# EAGLE design v0.4.5 (EAGLE 7.1.0)
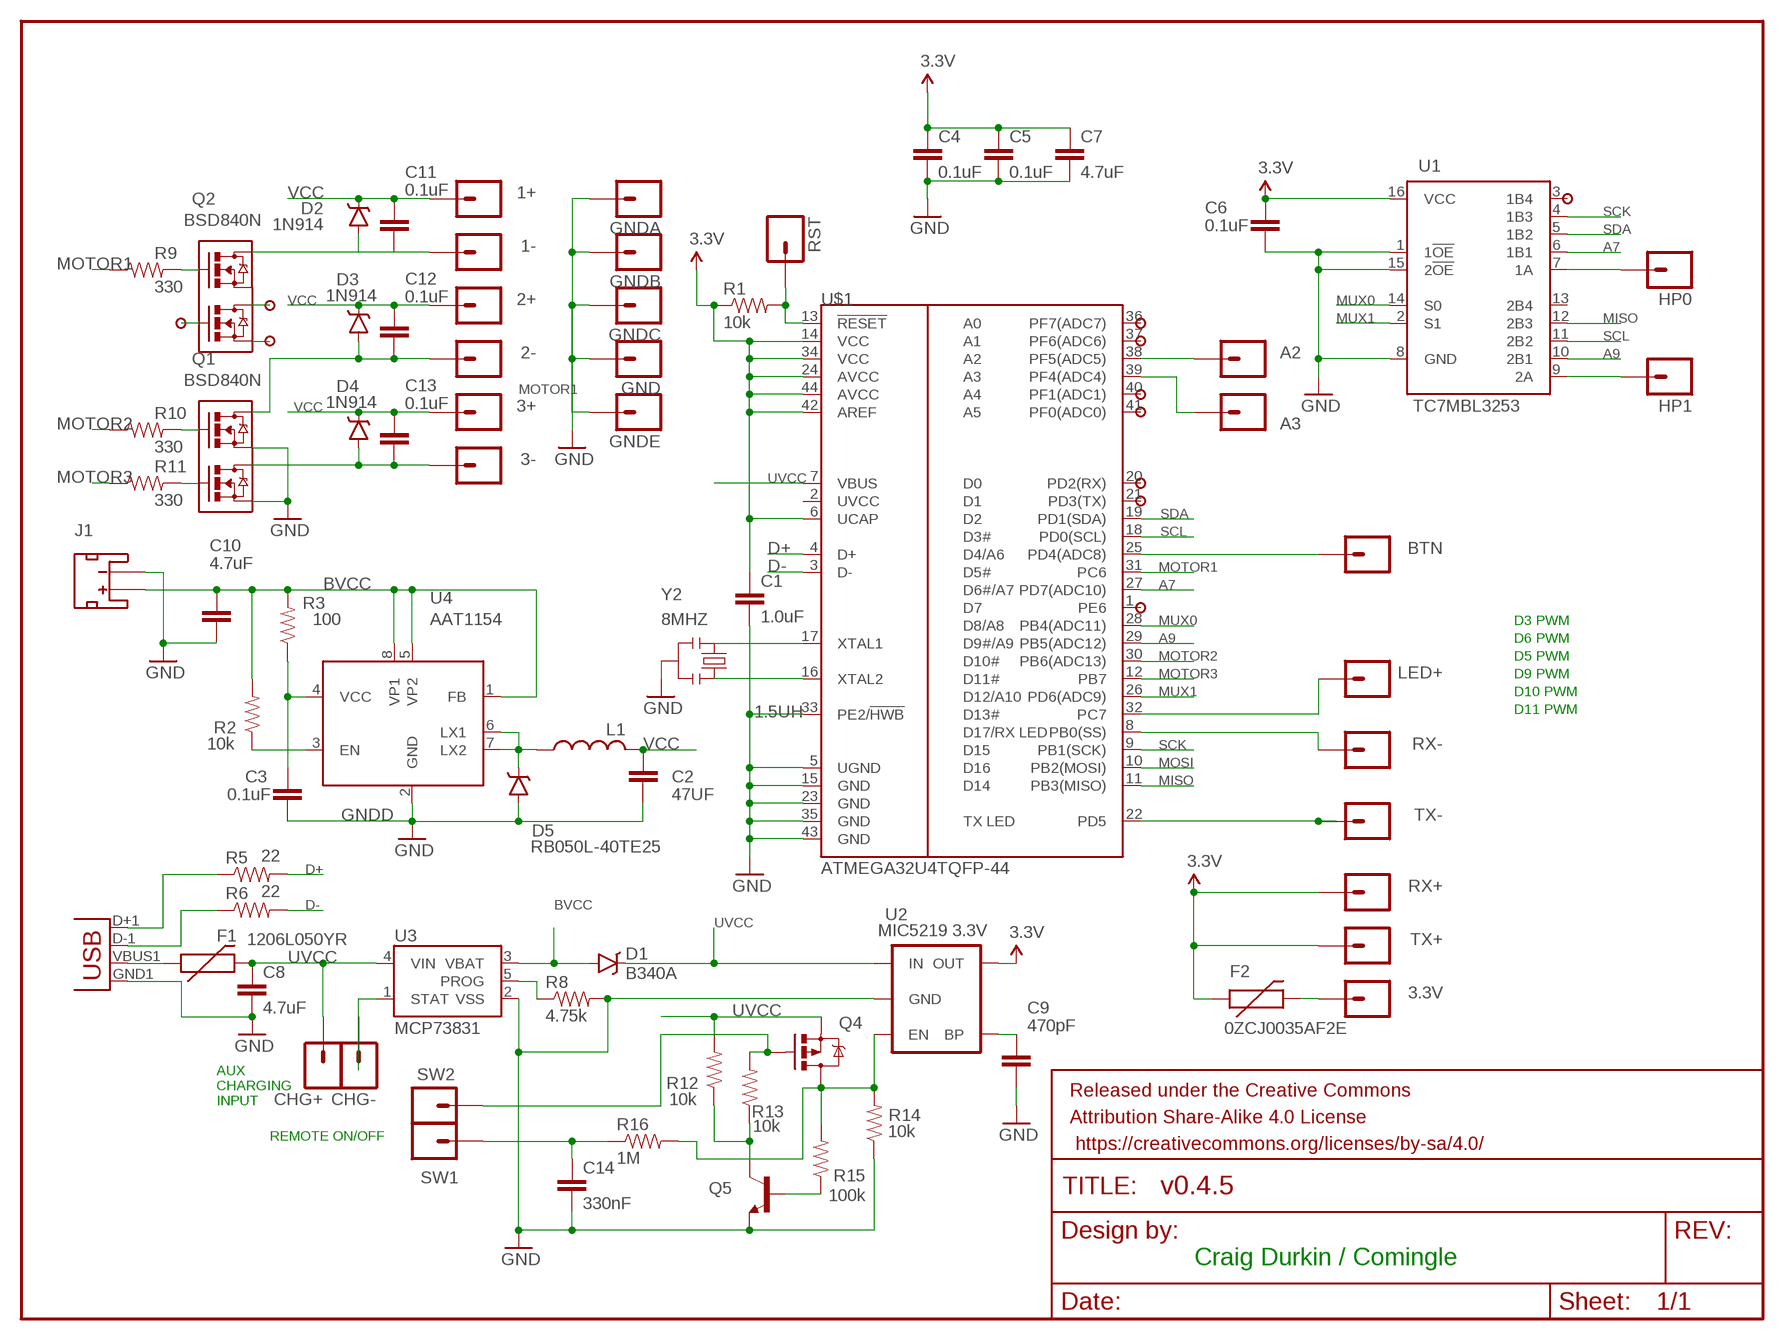
[diagram p0: schematic, sheet 1]

## Parts
1+  M01PTH  [1X01]
1-  M01PTH  [1X01]
2+  M01PTH  [1X01]
2-  M01PTH  [1X01]
3+  M01PTH  [1X01]
3-  M01PTH  [1X01]
3.3V  M01PTH  [1X01]
A2  M01PTH  [1X01]
A3  M01PTH  [1X01]
BTN  M01PTH  [1X01]
C1  1.0uF  CAP0603-CAP  [0603-CAP]
C2  47UF  CAP0805  [0805]
C3  0.1uF  CAP0603-CAP  [0603-CAP]
C4  0.1uF  CAP0603-CAP  [0603-CAP]
C5  0.1uF  CAP0603-CAP  [0603-CAP]
C6  0.1uF  CAP0603-CAP  [0603-CAP]
C7  4.7uF  CAP0603-CAP  [0603-CAP]
C8  4.7uF  CAP1206  [1206]
C9  470pF  CAP0603-CAP  [0603-CAP]
C10  4.7uF  CAP1206  [1206]
C11  0.1uF  CAP0603-CAP  [0603-CAP]
C12  0.1uF  CAP0603-CAP  [0603-CAP]
C13  0.1uF  CAP0603-CAP  [0603-CAP]
C14  330nF  CAP0603-CAP  [0603-CAP]
CHG+  M01PTH  [1X01]
CHG-  M01PTH  [1X01]
D1  B340A  DIODE-SCHOTTKY-B340A  [SMA-DIODE]
D2  1N914  BAT20JFILM  [SOD-323]
D3  1N914  BAT20JFILM  [SOD-323]
D4  1N914  BAT20JFILM  [SOD-323]
D5  RB050L-40TE25  DIODE-SCHOTTKY-B340A  [SMA-DIODE]
F1  1206L050YR  PTCSMD  [PTC-1206]
F2  0ZCJ0035AF2E  PTCSMD  [PTC-1206]
FRAME1  FRAME-LETTER  [CREATIVE_COMMONS]
GND  M01PTH  [1X01]
GNDA  M01PTH  [1X01]
GNDB  M01PTH  [1X01]
GNDC  M01PTH  [1X01]
GNDE  M01PTH  [1X01]
HP0  M01PTH  [1X01]
HP1  M01PTH  [1X01]
J1  JST_2MM_MALE  [JST-2-SMD]
JP4  USB  [USB-B-MICRO-SMD_V03]
L1  1.5UH  LQH5BPN1R5NT0L_INDUCTOR  [CHOKE_5MM]
LED+  M01PTH  [1X01]
PD2  040_PAD_030_HOLE  [040_PAD_O30_HOLE]
PD3  040_PAD_030_HOLE  [040_PAD_O30_HOLE]
PD4  040_PAD_030_HOLE  [040_PAD_O30_HOLE]
PD5  040_PAD_030_HOLE  [040_PAD_O30_HOLE]
PD6  040_PAD_030_HOLE  [040_PAD_O30_HOLE]
PD7  040_PAD_030_HOLE  [040_PAD_O30_HOLE]
PD8  040_PAD_030_HOLE  [040_PAD_O30_HOLE]
PD9  040_PAD_030_HOLE  [040_PAD_O30_HOLE]
PD10  040_PAD_030_HOLE  [040_PAD_O30_HOLE]
PD11  040_PAD_030_HOLE  [040_PAD_O30_HOLE]
PD12  040_PAD_030_HOLE  [040_PAD_O30_HOLE]
Q1  BSD840N  [PG-SOT-363]
Q2  BSD840N  [PG-SOT-363]
Q4  NTS2101PT1G  MOSFET-PCHANNEL  [SOT23-3]
Q5  MMBT2222A  TRANSISTOR_NPNMMBT2222A  [SOT23-3]
R1  10k  RESISTOR0603-RES  [0603-RES]
R2  10k  RESISTOR0603-RES  [0603-RES]
R3  100  RESISTOR0603-RES  [0603-RES]
R5  22  RESISTOR0603-RES  [0603-RES]
R6  22  RESISTOR0603-RES  [0603-RES]
R8  4.75k  RESISTOR0603-RES  [0603-RES]
R9  330  RESISTOR0603-RES  [0603-RES]
R10  330  RESISTOR0603-RES  [0603-RES]
R11  330  RESISTOR0603-RES  [0603-RES]
R12  10k  RESISTOR0603-RES  [0603-RES]
R13  10k  RESISTOR0603-RES  [0603-RES]
R14  10k  RESISTOR0603-RES  [0603-RES]
R15  100k  RESISTOR0603-RES  [0603-RES]
R16  1M  RESISTOR0603-RES  [0603-RES]
RST  M01PTH  [1X01]
RX+  M01PTH  [1X01]
RX-  M01PTH  [1X01]
SW1  M01PTH  [1X01]
SW2  M01PTH  [1X01]
TX+  M01PTH  [1X01]
TX-  M01PTH  [1X01]
U1  TC7MBL3253  [SSOP16-PRACTICE]
U2  MIC5219 3.3V  V_REG_MIC52193.3V  [SOT23-5]
U3  MCP73831  [SOT23-5]
U4  AAT1154  [SOP-8]
U$1  ATMEGA32U4TQFP-44  [TQFP44]
Y2  8MHZ  RESONATOR8MHZ  [RESONATOR-SMD]

## Nets
A7: U1.6(1B1) U$1.27(PD7(ADC10))
A9: U1.10(2B1) U$1.29(PB5(ADC12))
BVCC: C10.1 D1.A J1.2(+) R2.2 R3.2 U3.3(VBAT) U4.1(FB) U4.5(VP2) U4.8(VP1)
D+: R5.2 U$1.4(D+)
D-: R6.2 U$1.3(D-)
GNDD: C1.2 C2.2 C3.2 C4.2 C5.2 C6.2 C7.2 C8.2 C9.2 C10.2 C14.2 D5.A GND.1 GNDA.1 GNDB.1 GNDC.1 GNDE.1 J1.1(-) JP4.GND1(GND) Q1.1(S) Q1.4(S1) Q5.2(E) R8.2 R14.1 U1.1(1!OE) U1.8(GND) U1.15(2!OE) U2.2(GND) U3.2(VSS) U4.2(GND) U$1.5(UGND) U$1.15(GND) U$1.23(GND) U$1.33(PE2/!HWB) U$1.35(GND) U$1.43(GND) Y2.2 ; supply symbol labelled GND
MISO: U1.12(2B3) U$1.11(PB3(MISO))
MOSI: U$1.10(PB2(MOSI))
MOTOR1: R9.1 U$1.31(PC6)
MOTOR2: R10.1 U$1.30(PB6(ADC13))
MOTOR3: R11.1 U$1.12(PB7)
MUX0: U1.14(S0) U$1.28(PB4(ADC11))
MUX1: U1.2(S1) U$1.26(PD6(ADC9))
N$1: U$1.17(XTAL1) Y2.1
N$2: R8.1 U3.5(PROG)
N$3: D5.C L1.1 U4.6(LX1) U4.7(LX2)
N$4: F1.1 JP4.VBUS1(VBUS)
N$5: 3.3V.1 F2.2
N$6: U$1.16(XTAL2) Y2.3
N$7: LED+.1 U$1.32(PC7)
N$8: RX-.1 U$1.8(PB0(SS))
N$9: TX-.1 U$1.22(PD5)
N$10: JP4.D+1(D+) R5.1
N$11: JP4.D-1(D-) R6.1
N$12: Q4.3(D) R14.2 R15.2 R16.2 U2.3(EN)
N$13: HP1.1 U1.9(2A)
N$14: HP0.1 U1.7(1A)
N$15: A2.1 U$1.38(PF5(ADC5))
N$16: A3.1 U$1.39(PF4(ADC4))
N$17: BTN.1 U$1.25(PD4(ADC8))
N$18: Q2.2(G) R9.2
N$19: CHG-.1 U3.1(STAT)
N$20: Q5.3(C) R12.1 R13.1
N$21: C14.1 R16.1 SW1.1
N$22: C9.1 U2.4(BP)
N$23: Q4.1(G) R13.2 SW2.1
N$24: 1-.1 C11.2 D2.A Q2.6(D)
N$25: 2-.1 C12.2 D3.A Q1.6(D)
N$26: 3-.1 C13.2 D4.A Q1.3(D1)
N$27: PD3.1 U$1.21(PD3(TX))
N$28: PD4.1 U$1.20(PD2(RX))
N$29: PD5.1 U$1.41(PF0(ADC0))
N$30: Q5.1(B) R15.1
N$31: R2.1 U4.3(EN)
N$32: C3.1 R3.1 U4.4(VCC)
N$33: PD6.1 U$1.40(PF1(ADC1))
N$34: PD7.1 U$1.37(PF6(ADC6))
N$35: PD8.1 U$1.36(PF7(ADC7))
N$36: PD9.1 U$1.1(PE6)
N$38: PD2.1 U1.3(1B4)
N$40: PD10.1 Q2.5(G1)
N$41: PD11.1 Q2.4(S1)
N$42: PD12.1 Q2.3(D1)
N$43: Q1.2(G) R10.2
N$44: Q1.5(G1) R11.2
RST: R1.2 RST.1 U$1.13(!RESET)
SCK: U1.4(1B3) U$1.9(PB1(SCK))
SCL: U1.11(2B2) U$1.18(PD0(SCL))
SDA: U1.5(1B2) U$1.19(PD1(SDA))
UVCC: C8.1 CHG+.1 D1.C F1.2 Q4.2(S) R12.2 U2.1(IN) U3.4(VIN) U$1.7(VBUS)
VCC: 1+.1 2+.1 3+.1 C1.1 C2.1 C4.1 C5.1 C6.1 C7.1 C11.1 C12.1 C13.1 D2.C D3.C D4.C F2.1 L1.2 R1.1 RX+.1 TX+.1 U1.16(VCC) U2.5(OUT) U$1.6(UCAP) U$1.14(VCC) U$1.24(AVCC) U$1.34(VCC) U$1.42(AREF) U$1.44(AVCC) ; supply symbol labelled 3.3V
Unconnected: J1.NC1(PAD1) J1.NC2(PAD2) Q2.1(S) U1.13(2B4) U$1.2(UVCC)

## Notes on the sheet
- D3 PWM
- D6 PWM
- D5 PWM
- D9 PWM
- D10 PWM
- D11 PWM
- AUX
  CHARGING
  INPUT
- REMOTE ON/OFF
- Craig Durkin / Comingle

## Library data of the parts
1+ 1- 2+ 2- 3+ 3- 3.3V A2 A3 BTN CHG+ CHG- GND GNDA GNDB GNDC GNDE HP0 HP1 LED+ RST RX+ RX- SW1 SW2 TX+ TX- = SparkFun-Connectors:M01: Header 1 Standard 1-pin 0.1" header. Use with straight break away headers (SKU : PRT-00116), right angle break away headers (PRT-00553), swiss pins (PRT-00743), machine pins (PRT-00117), and female headers (PRT-00115).
C1 C9 C11-C14 = SparkFun-Capacitors:CAP: Capacitor Standard 0603 ceramic capacitor, and 0.1" leaded capacitor.
C2 = v0.4.5:CAP: Capacitor Standard 0603 ceramic capacitor, and 0.1" leaded capacitor.
C3-C8 C10 = SparkFun-Passives:CAP: Capacitor Standard 0603 ceramic capacitor, and 0.1" leaded capacitor.
D1 = SparkFun-DiscreteSemi:DIODE-SCHOTTKY: Schottky diodes in SFE's production catalog BAT20J 1A 23V 0.62Vf RB751 120mA 40V 0.37Vf PMEG4005EJ 0.5A 40V 0.42Vf MBRA140 1A 40V 0.5Vf B340A 3A 40V SMA; PROD_ID: DIO-09886
D2-D4 = SparkFun-DiscreteSemi:BAT20JFILM: 23V, 1A Schottky diode, SOD-323 package; PROD_ID: DIO-11623; VALUE: BAT20JFILM
D5 = v0.4.5:DIODE-SCHOTTKY: Schottky diodes in SFE's production catalog BAT20J 1A 23V 0.62Vf RB751 120mA 40V 0.37Vf PMEG4005EJ 0.5A 40V 0.42Vf MBRA140 1A 40V 0.5Vf B340A 3A 40V SMA; PROD_ID: DIO-09886; VALUE: B340A
F1 F2 = SparkFun-PowerIC:PTC: Resettable Fuse PTC Resettable Fuse. Spark Fun Electronics SKU : COM-08357; PROD_ID: RES-11150
FRAME1 = SparkFun-Aesthetics:FRAME-LETTER: Schematic Frame Standard 8.5x11 US Letter frame
J1 = SparkFun-Connectors:JST_2MM_MALE: Mates to single-cell LiPo batteries. CONN-08352; PROD_ID: CONN-08352
JP4 = SparkFun-Connectors:USB: USB Connectors USB-B-PTH is fully proven SKU : PRT-00139/CONN-08278 USB-miniB is fully proven SKU : PRT-00587 USB-A-PCB is untested. USB-A-H is throughly reviewed, but untested. Spark Fun Electronics SKU : PRT-00437 USB-B-SMT is throughly reviewed, but untested. Needs silkscreen touching up. USB-A-S has not been used/tested USB-MB-H has not been used/tested USB-MICROB has been used. CONN-09505
L1 = v0.4.5:LQH5BPN1R5NT0L_INDUCTOR
PD2-PD12 = CLAVE:040_PAD_030_HOLE
Q1 Q2 = v0.4.5:BSD840N
Q4 = SparkFun-DiscreteSemi:MOSFET-PCHANNEL: Generic PMOSFET IRLML2244 - TRANS-11153 (SOT-23 -20V -4.3A) (1.Gate 2.Source 3.Drain) FQP27P06 - COM-10349 <http://www.sparkfun.com/products/10349> (TO-220 -60V -27A) (1.Gate 2.Source 3.Drain); PROD_ID: TRANS-08285
Q5 = SparkFun-DiscreteSemi:TRANSISTOR_NPN: Generic NPN BJT MMBT2222A - TRANS-08049 (SOT-23, 1A 40V) MPSA42 - TRANS-09116 (SOT-23, 500mA 300V) MMBT5088LT1G - TRANS-11160 (SOT-23, 50 mA 30V) BC547 - COM-08928 <http://www.sparkfun.com/products/8928> (TO-92 45V 100mA) (1.Collector 2.Base 3.Emitter) 2N3904 - COM-00521 <http://www.sparkfun.com/products/521> (TO-92 40V 200mA) (1.Emitter 2.Base 3.Collector) P2N2222A - COM-12852 <http://www.sparkfun.com/products/12852> (TO-92 40V 600mA) (1.Collector 2.Base 3.Emitter); PROD_ID: TRANS-08049
R1-R3 R5 R6 R8-R16 = SparkFun-Passives:RESISTOR: Resistor Basic schematic elements and footprints for 0603, 1206, and PTH resistors.
U1 = SparkFun-DigitalIC:TC7MBL3253: 74CBT 2 x 4:1 multiplexer. 1OE and 2OE are output enable pins, and S0 and S1 determine which ouptut (xB4, xB3, ...) is connected to the xA
U2 = SparkFun-PowerIC:V_REG_MIC5219: V_REG MIC5219 Standard 3.3V and 5V 500mA LDO voltage regulator in SOT-23 layout. Micrel part MIC5219. BP (by-pass) pin is used to lower output noise with 470pF cap, may be left open.; PROD_ID: VREG-09872
U3 = SparkFun-PowerIC:MCP73831: Miniature single cell, fully integrated Li-Ion, Li-polymer charge management controller http://ww1.microchip.com/downloads/en/DeviceDoc/21984a.pdf IC-09995; PROD_ID: IC-09995
U4 = v0.4.5:AAT1154
U$1 = SparkFun-DigitalIC:ATMEGA32U4: Atmel 44-pin 8-bit Microcontroller with 32KBytes of ISP Flash and USB Controller
Y2 = SparkFun-FreqCtrl:RESONATOR: Resonator Small SMD resonator. Used, eg, on the Arduino Pro/ Pro Mini boards. 8MHz- XTAL-08895 16MHz- XTAL-08900; PROD_ID: XTAL-08895

## Net classes
0 default: width 0.254 mm, drill 0.051 mm, clearance 0.254 mm

## Board
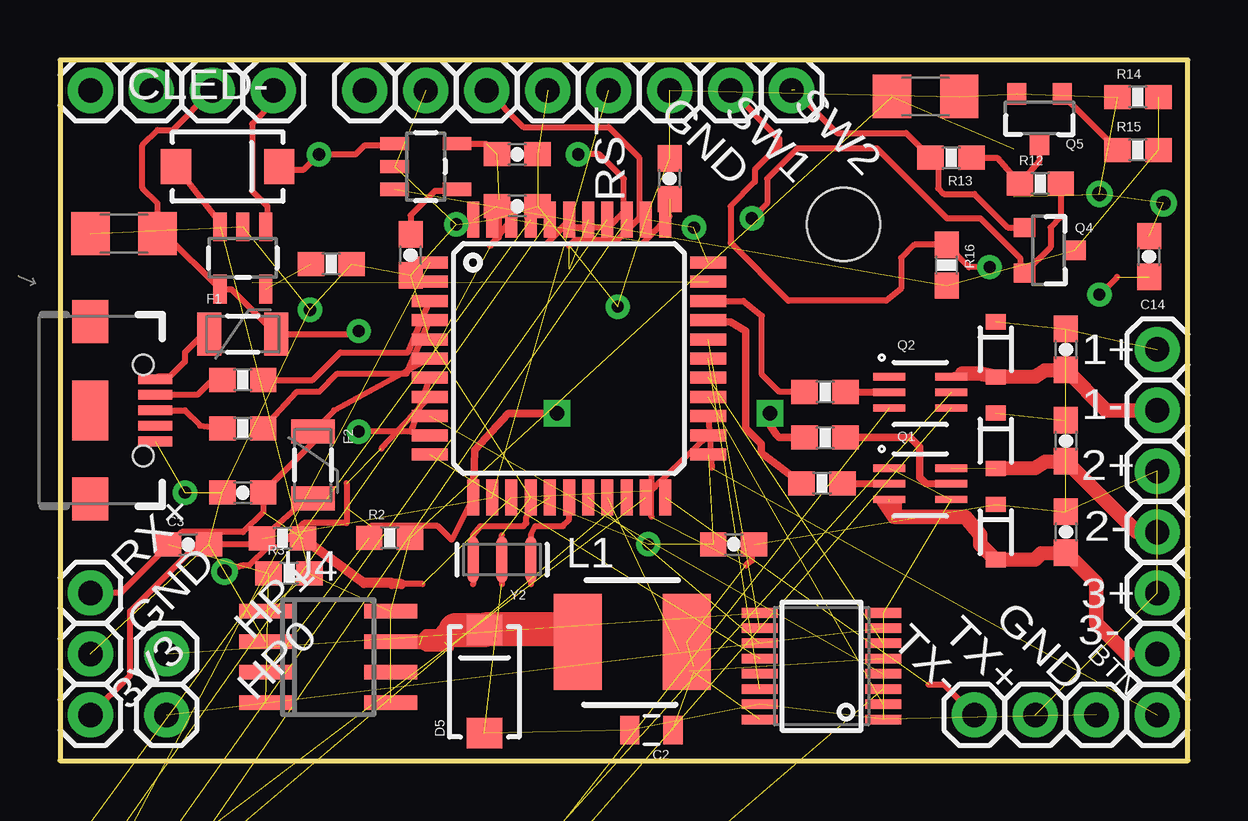
[diagram p1: board, top side]
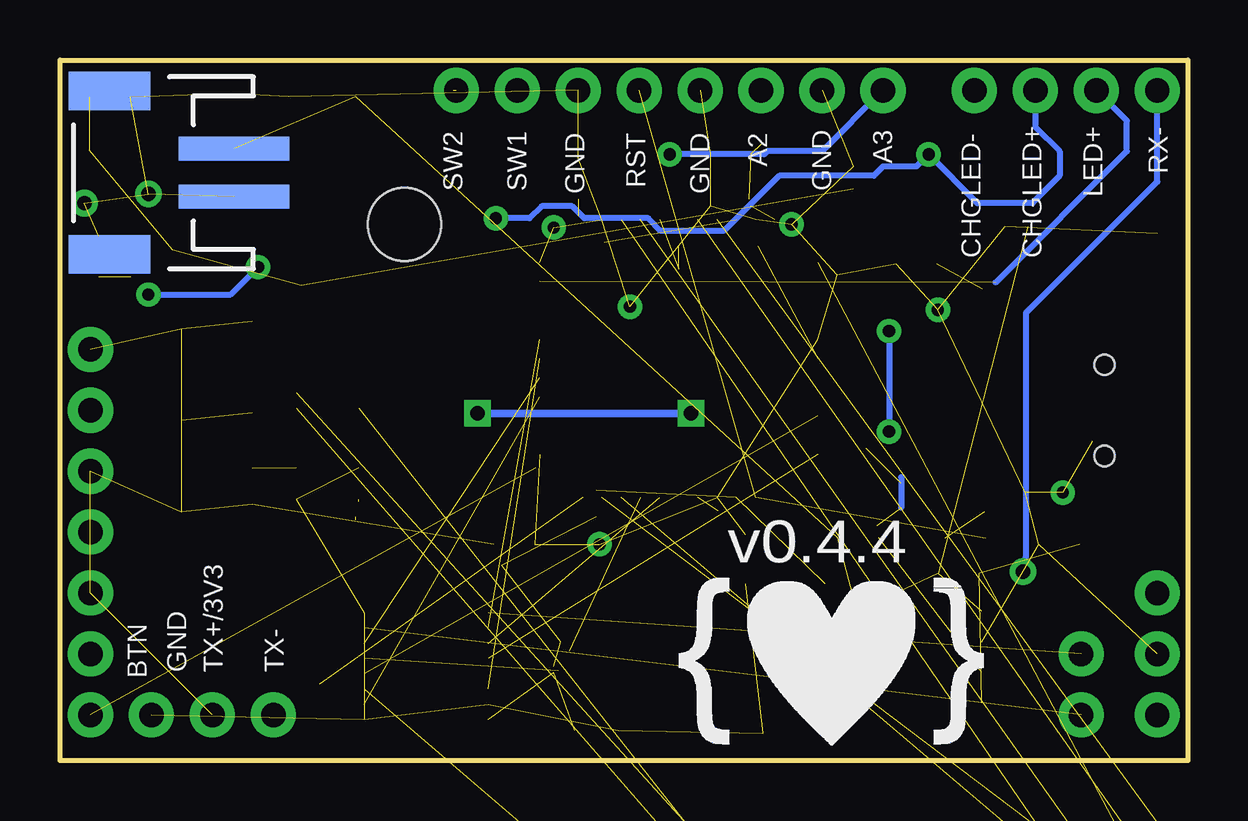
[diagram p2: board, bottom side, seen from below]

Size 46.99 x 29.21 mm. Coordinates in mm from the lower left corner, seen from the top.
Outline: 0,0 46.99,0 46.99,29.21 0,29.21 0,0
Copper layers (1*16): Top 0.035mm / dielectric 1.5mm / Bottom 0.035mm
Design rules "SparkFun *": minimum track width 8mil, minimum drill 20mil, track to track 8mil, track to pad 8mil, pad to pad 8mil, via to via 8mil, smd to smd 8mil, copper to edge 10mil, drill to drill 8mil, minimum pad ring 12mil, minimum via ring 10mil, stop-mask expansion 4mil, vias tented up to drill 19mil, thermal gap 10mil

### Footprints (pad centres in the part's own frame; a part is rotated, then mirrored left to right if it is on the bottom)
1X01 = drill 1.016 pad 1.88: 1 0,0
0603-CAP = smd 1.1 x 1: 1 -0.85,0; 2 0.85,0
0805 = smd 0.8 x 1.2: 1 -0.9,0; 2 0.9,0
1206 = smd 1.6 x 1.8: 1 -1.4,0; 2 1.4,0
SMA-DIODE = smd 1.27 x 1.47: A -2.15,0; C 2.15,0
SOD-323 = smd 0.63 x 0.83: A 1.15,0; C -1.15,0
PTC-1206 = smd 1 x 1.8: 1 -1.4,0; 2 1.4,0
JST-2-SMD = smd 1 x 4.6: 1 -1,-3.7; 2 1,-3.7 | smd 1.6 x 3.4: NC1 -3.4,1.5; NC2 3.4,1.5
USB-B-MICRO-SMD_V03 = smd 1.4 x 0.4: D+1 2.7,0; D-1 2.7,0.65; GND1 2.7,-1.3; ID1 2.7,-0.65; VBUS1 2.7,1.3 | smd 1.5 x 1.8: SHIELD1 0,3.7; SHIELD2 0,-3.7 | smd 1.5 x 2.5: SHIELD3 0,0 | hole 0.85: 2.2,1.9; 2.2,-1.9
CHOKE_5MM = smd 2 x 4: 1 -2.28,0; 2 2.28,0
040_PAD_O30_HOLE = drill 0.762 pad 1.016: 1 0,0
PG-SOT-363 = smd 0.3 x 1.33: 1 0,0; 2 0.65,0; 3 1.3,0; 4 1.3,2.6; 5 0.65,2.6; 6 0,2.6
SOT23-3 = smd 0.8 x 0.9: 1 -0.95,-1; 2 0.95,-1; 3 0,1.1
0603-RES = smd 1.1 x 1: 1 -0.85,0; 2 0.85,0
SSOP16-PRACTICE = smd 0.4 x 1.5: 1 -2.223,-2.578; 2 -1.587,-2.578; 3 -0.953,-2.578; 4 -0.318,-2.578; 5 0.318,-2.578; 6 0.953,-2.578; 7 1.587,-2.578; 8 2.223,-2.578; 9 2.223,2.578; 10 1.587,2.578; 11 0.953,2.578; 12 0.318,2.578; 13 -0.318,2.578; 14 -0.953,2.578; 15 -1.587,2.578; 16 -2.223,2.578
SOT23-5 = smd 0.55 x 1.2: 1 -0.95,-1.3; 2 0,-1.3; 3 0.95,-1.3; 4 0.95,1.3; 5 -0.95,1.3
SOP-8 = smd 0.6 x 2.2: 1 -1.27,-2.727; 2 0,-2.727; 3 1.27,-2.727; 4 2.54,-2.727; 5 2.54,2.473; 6 1.27,2.473; 7 0,2.473; 8 -1.27,2.473
TQFP44 = smd 1.5 x 0.5: 1 -5.8,4; 2 -5.8,3.2; 3 -5.8,2.4; 4 -5.8,1.6; 5 -5.8,0.8; 6 -5.8,0; 7 -5.8,-0.8; 8 -5.8,-1.6; 9 -5.8,-2.4; 10 -5.8,-3.2; 11 -5.8,-4; 23 5.8,-4; 24 5.8,-3.2; 25 5.8,-2.4; 26 5.8,-1.6; 27 5.8,-0.8; 28 5.8,0; 29 5.8,0.8; 30 5.8,1.6; 31 5.8,2.4; 32 5.8,3.2; 33 5.8,4 | smd 0.5 x 1.5: 12 -4,-5.8; 13 -3.2,-5.8; 14 -2.4,-5.8; 15 -1.6,-5.8; 16 -0.8,-5.8; 17 0,-5.8; 18 0.8,-5.8; 19 1.6,-5.8; 20 2.4,-5.8; 21 3.2,-5.8; 22 4,-5.8; 34 4,5.8; 35 3.2,5.8; 36 2.4,5.8; 37 1.6,5.8; 38 0.8,5.8; 39 0,5.8; 40 -0.8,5.8; 41 -1.6,5.8; 42 -2.4,5.8; 43 -3.2,5.8; 44 -4,5.8
STAND-OFF-TIGHT = hole 3.048: 0,0
RESONATOR-SMD = smd 0.45 x 1.905: 1 -1.2,0; 2 0,0; 3 1.2,0

### Placement (x,y rotation side)
1+  45.72,17.14 0 top
1-  45.72,14.61 0 top
2+  45.72,12.06 0 top
2-  45.72,9.53 0 top
3+  45.72,6.99 0 top
3-  45.72,4.45 0 top
3.3V  1.27,1.91 0 top
A2  17.78,27.94 0 top
A3  12.7,27.94 0 top
BTN  45.72,1.91 0 top
C1  7.62,11.18 180 top
C2  24.64,1.27 180 top
C3  5.35,9 0 top
C4  28.07,9.02 180 top
C5  19.05,23.11 0 top
C6  25.4,24.26 90 top
C7  19.05,25.27 0 top
C8  2.67,21.97 180 top
C9  14.61,21.08 270 top
C10  36.07,27.69 0 top
C11  41.91,17.14 270 top
C12  41.91,13.34 270 top
C13  41.91,9.53 270 top
C14  45.38,21.02 90 top
CHG+  6.35,27.94 0 top
CHG-  8.89,27.94 0 top
D1  6.99,24.77 0 top
D2  38.99,17.14 270 top
D3  38.99,13.34 270 top
D4  38.99,9.53 270 top
D5  17.68,3.29 90 top
F1  7.62,17.78 0 top
F2  10.54,12.32 270 top
FRAME1  5.08,-10.16 0 top  (outside the outline)
GND  20.32,27.94 0 top
GNDA  1.27,4.45 0 top
GNDB  43.18,1.91 0 top
GNDC  25.4,27.94 0 top
GNDE  15.24,27.94 0 top
HP0  4.45,1.91 0 top
HP1  4.45,4.45 0 top
J1  43.43,24.51 90 bottom
JP4  1.27,14.61 0 top
L1  23.84,4.95 0 top
LED+  3.81,27.94 0 top
PD2  -14.73,-39.12 0 top  (outside the outline)
PD3  -14.73,-18.67 0 top  (outside the outline)
PD4  -14.73,-21.59 0 top  (outside the outline)
PD5  -14.73,-24.51 0 top  (outside the outline)
PD6  -14.73,-27.43 0 top  (outside the outline)
PD7  -14.73,-30.35 0 top  (outside the outline)
PD8  -14.73,-33.27 0 top  (outside the outline)
PD9  -14.73,-36.2 0 top  (outside the outline)
PD10  -14.73,-42.04 0 top  (outside the outline)
PD11  -14.73,-44.96 0 top  (outside the outline)
PD12  -14.73,-47.88 0 top  (outside the outline)
Q1  34.54,12.19 270 top
Q2  34.54,16 270 top
Q4  41.18,21.27 270 top
Q5  40.81,26.8 180 top
R1  9.27,9.27 180 top
R2  13.73,9.29 0 top
R3  9.54,7.81 0 top
R5  7.62,13.84 0 top
R6  7.62,15.88 0 top
R8  11.3,20.7 0 top
R9  31.88,15.37 0 top
R10  31.75,11.56 0 top
R11  31.88,13.46 0 top
R12  40.85,24.05 0 top
R13  37.13,25.14 180 top
R14  44.91,27.66 0 top
R15  44.91,25.46 0 top
R16  36.94,20.65 270 top
RST  22.86,27.94 0 top
RX+  1.27,6.99 0 top
RX-  1.27,27.94 0 top
SW1  27.94,27.94 0 top
SW2  30.48,27.94 0 top
TX+  40.64,1.91 0 top
TX-  38.1,1.91 0 top
U1  31.73,3.94 90 top
U2  15.24,24.77 270 top
U3  7.62,20.95 180 top
U4  11.3,4.95 270 top
U$1  21.21,16.76 0 top
U$2  [STAND-OFF-TIGHT]  32.64,22.35 0 top
Y2  18.41,8.38 180 top

### Tracks (layer width: path | path; a pad name or v marks a point on that pad's centre or on a via)
A7  (1 unrouted)
A9  (1 unrouted)
BVCC  (7 unrouted)
  Top 0.254: D1.A 6.74,22.32 U3.3
D+
  Top 0.254: U$1.4 14.44,16.13 11.56,16.13 10.79,15.37 9.87,15.37 R5.2
D-
  Top 0.254: R6.2 10.54,15.88 11.68,17.02 14.51,17.02 U$1.3
GNDD  (via drill 0.51 pad 0.81, 0.6 pad 1.02)  (44 unrouted)
  other vias: 5.21,11.18 24.51,9.02 23.24,18.92 16.51,22.35 43.31,23.62 45.97,23.24 10.41,18.8 26.42,22.23
MISO  (1 unrouted)
MOTOR1
  Top 0.254: U$1.31 28.47,19.16 29.25,18.54 29.25,16.09 29.97,15.37 R9.1
MOTOR2
  Top 0.305: R10.1 29.21,12.83 29.21,13.21 28.57,13.84 28.57,17.91 27.94,18.29 U$1.30
MOTOR3  (via drill 0.6)  (1 unrouted)
  Top 0.254: U$1.12 16.32,9.21 15.75,9.78 12.95,9.78 12.83,9.65
  Top 0.305: R11.1 29.97,13.46 29.84,13.59 29.59,13.97 v29.59,14.48 | v20.7,14.48 18.67,14.48 17.27,12.95 U$1.12
  Bottom 0.254: 11.94,11.81 11.94,10.54
  Bottom 0.305: v29.59,14.48 v20.7,14.48
MUX0  (1 unrouted)
MUX1  (1 unrouted)
N$1
  Top 0.254: 19.61,9.4 19.81,9.78 20.95,9.78 21.21,10.03 U$1.17
N$2  (1 unrouted)
N$3  (3 unrouted)
  Top 0.305: 15.75,5.33 15.24,5.33 15.11,5.21 | 16.26,4.7 15.24,4.7 14.99,4.83
  Top 0.61: 16.49,5.44 16,4.95 U4.7
  Top 1.016: 17.68,5.46 D5.C
  Top 1.27: L1.1 21.09,5.46
  Top 1.422: 21.09,5.46 17.68,5.46 | D5.C 16.49,5.44
N$4
  Top 0.254: F1.1 5.97,17.78 5.21,17.02 5.21,16.64 4.57,16 4.07,16 JP4.VBUS1
N$5
  Top 0.254: F2.2 10.28,10.92 8.13,9.02 5.71,9.02 2.92,6.22 2.92,3.56 3.3V.1
N$6  (1 unrouted)
  Top 0.254: 17.21,9.4 17.53,9.78 19.3,9.78 19.43,9.91 19.43,10.16 19.56,10.29 19.56,10.41
N$7  (1 unrouted)
  Bottom 0.254: 8,19.94 2.54,25.4 2.54,26.67 LED+.1
N$8  (via drill 0.6)  (1 unrouted)
  Top 0.254: U$1.8 13.39,13.01 | 11.94,11.56 11.94,9.91 10.16,9.91 9.14,8.89 8.64,8.89 7.87,8.13 7.62,8.13 v6.86,7.87
  Bottom 0.254: v6.86,7.87 6.86,8.13 6.73,8.51 6.73,18.67 1.27,24.13 RX-.1
N$9  (1 unrouted)
  Top 0.254: 38.06,1.94 TX-.1 36.83,3.17 36.2,3.17
N$10
  Top 0.254: JP4.D+1 5.21,14.61 5.84,13.97 R5.1
N$11
  Top 0.254: JP4.D-1 5.73,15.26 6.22,15.75 6.64,15.75 R6.1
N$12  (4 unrouted)
N$13  (1 unrouted)
N$14  (1 unrouted)
N$15  (2 unrouted)
  Top 0.254: 21.21,21.46 21.46,21.72 23.24,21.72 24.13,22.61 24.13,25.15 22.86,26.42 19.3,26.42 A2.1
N$16  (via drill 0.51 pad 0.81)
  Top 0.254: U$1.39 20.32,21.59 20.95,22.23 22.86,22.23 23.5,22.86 23.5,24.26 22.48,25.27 v21.59,25.27
  Bottom 0.254: A3.1 15.24,25.4 17.53,25.4 17.65,25.27 v21.59,25.27
N$17  (1 unrouted)
  Top 0.254: U$1.25 27.16,12.21
N$18
  Top 0.305: R9.2 Q2.2
N$19
  Top 0.254: U3.1 8.64,22.32 8.64,23.11 8,23.75 8,26.54 8.89,27.43 CHG-.1
N$20
  Top 0.254: R13.1 39.04,25.14 R12.1 40.81,24.99 Q5.3
N$21  (via drill 0.51 pad 1.02)  (1 unrouted)
  Top 0.254: 44.04,20.17 v43.31,19.43 | v38.73,20.57 37.87,20.57 R16.1 35.6,21.5 35.05,20.95 35.05,19.68 34.42,19.18 30.35,19.18 27.94,21.59 27.94,23.11 28.96,24.13 28.96,24.64 29.97,25.65 29.97,25.91 SW1.1
  Bottom 0.254: v43.31,19.43 39.88,19.43 v38.73,20.57
N$22
  Top 0.254: U2.4 16.47,23.75 15.62,23.75 14.61,22.73 C9.1
N$23  (1 unrouted)
  Top 0.254: Q4.1 39.5,22.23 38.1,23.62 36.83,23.62 36.59,23.87 36.59,25.14 R13.2 35.25,26.16 32.38,26.16 30.61,27.94
N$24
  Top 0.254: C11.2 41.61,15.99
  Top 0.305: 37.59,16.13 Q2.6
  Top 0.61: 1-.1 43.6,14.61 C11.2 41.02,16.26 40.64,16 D2.A 38.35,16.13 37.59,16.13
N$25  (1 unrouted)
  Top 0.254: 44.87,9.53 2-.1
  Top 0.61: 44.87,9.53 C12.2 41.02,12.45 40.64,12.19 D3.A
N$26  (2 unrouted)
  Top 0.254: C13.2 41.61,8.38 | 44.45,4.45 3-.1
  Top 0.305: 34.8,10.16 34.42,10.41 Q1.3 | 34.92,10.16 34.92,10.79 | 34.67,10.79 34.67,10.16 34.54,10.79 | 34.67,10.03 34.16,10.79
  Top 0.61: 44.45,4.45 43.18,5.71 43.18,7.41 C13.2 40.89,8.64 40.64,8.38 D4.A 38.35,9.02 38.35,9.4 37.72,10.16 34.92,10.16 34.8,10.16
N$27  (1 unrouted)
N$28  (1 unrouted)
N$29  (1 unrouted)
N$30
  Top 0.254: Q5.1 41.76,27.76 R15.1
N$31  (1 unrouted)
N$32  (2 unrouted)
N$33  (1 unrouted)
N$34  (1 unrouted)
N$35  (1 unrouted)
N$36  (1 unrouted)
N$37
  Top 0.305: 16.13,5.84 15.62,5.21
N$38  (1 unrouted)
N$39
  Top 0.305: 14.73,5.08 14.73,4.83 14.86,4.83
N$40  (1 unrouted)
N$41  (1 unrouted)
N$42  (1 unrouted)
N$43
  Top 0.305: R10.2 Q1.2
N$44
  Top 0.305: R11.2 35.43,13.46 35.81,13.08 35.81,11.81 36.07,11.56 Q1.5
RST  (2 unrouted)
SCK  (1 unrouted)
SCL  (1 unrouted)
SDA  (2 unrouted)
  Top 0.254: 25.78,4.57 25.78,4.19 26.23,3.75
UVCC  (via drill 0.51, 0.51 pad 1.02)
  Top 0.254: U$1.7 14.61,13.72 v12.45,13.72 | D1.C 9.26,24.64 10.16,24.64 v10.79,25.27 12.32,25.27 12.7,25.65 13.88,25.65 U2.1 | v28.83,22.61 29.46,23.24 29.46,24.26 30.73,25.53 34.04,25.53 36.96,22.61 38.35,22.61 40.01,20.95 40.01,20.5 Q4.2 41.27,21.41 41.27,22.23 41.7,22.65 R12.2 | v12.45,17.91 12.32,17.78 F1.2 7.14,19.66 U3.4 4.35,21.97 C8.1 4.07,23.24 3.43,23.88 3.43,25.65 4.06,26.29 4.7,26.29 CHG+.1
  Bottom 0.254: 12.32,13.72 v12.45,13.72 v12.45,17.91 | CHG+.1 6.35,26.42 5.33,25.4 5.33,24.38 6.48,23.24 8.76,23.24 v10.79,25.27 11.3,24.77 12.7,24.77 13.08,24.38 17.02,24.38 19.3,22.1 21.97,22.1 22.48,22.61 25.15,22.61 25.65,23.11 26.92,23.11 27.43,22.61 v28.83,22.61
VCC  (24 unrouted)
  Top 0.254: C5.1 18.29,23.41 18.29,21.82 17.92,21.45 U$1.42 | 24.79,11.4 U$1.24 | 15.11,7.37 14.22,7.37 | 24.64,11.94 24.64,11.56 24.79,11.4 | 24.64,10.16 24.64,11.25 24.79,11.4 | U$1.34 24.32,21.61 25.4,22.69 | 28.57,8.13 28.7,8.26 28.83,8.34 C4.1 | U$1.6 11.43,14.61 F2.1 10.54,13.25 C1.1 8.47,10.38 7.62,9.53 5.08,9.53 2.54,6.99 RX+.1 | U2.5 17.76,25.71
  Top 0.406: R1.1 12.66,7.41 13.84,7.41 13.84,7.37 14.22,7.37 | 26.42,3.68 26.29,3.81 26.42,3.94

### Text on the board
tPlace: CLED- | GND | SW1 | SW2 | RST | 1+ | 1- | 2+ | 2- | RX+ | 3+ | GND | HP1 | 3- | TX- | TX+ | GND | BTN | 3V3 | HP0
bPlace: RX- | A3 | A2 | GND | GND | RST | GND | SW1 | SW2 | LED+ | CHGLED+ | CHGLED- | v0.4.4 | TX- | TX+/3V3 | GND | BTN